# Altium schematic sheet 12 40PIN_FAN.SchDoc: CM4 IO
size 297 x 209 mm; Page Create Date: March  8, 1995; Page Number: 12; Page Size: A4; Comment: radxa_1010; Page Count: 19; RevCode: V1.10; Doc: 12 40PIN/FAN; DsnPath: D:\WMS\黄工\[RC126]CM4_IO_V1.10\[RC126]_V1.10\CM4 IO_V1.10.DSN; SchematicName: CM4 IO V1.10; PageName: 12 40PIN/FAN; PageSize: A4; TopSchematic: True
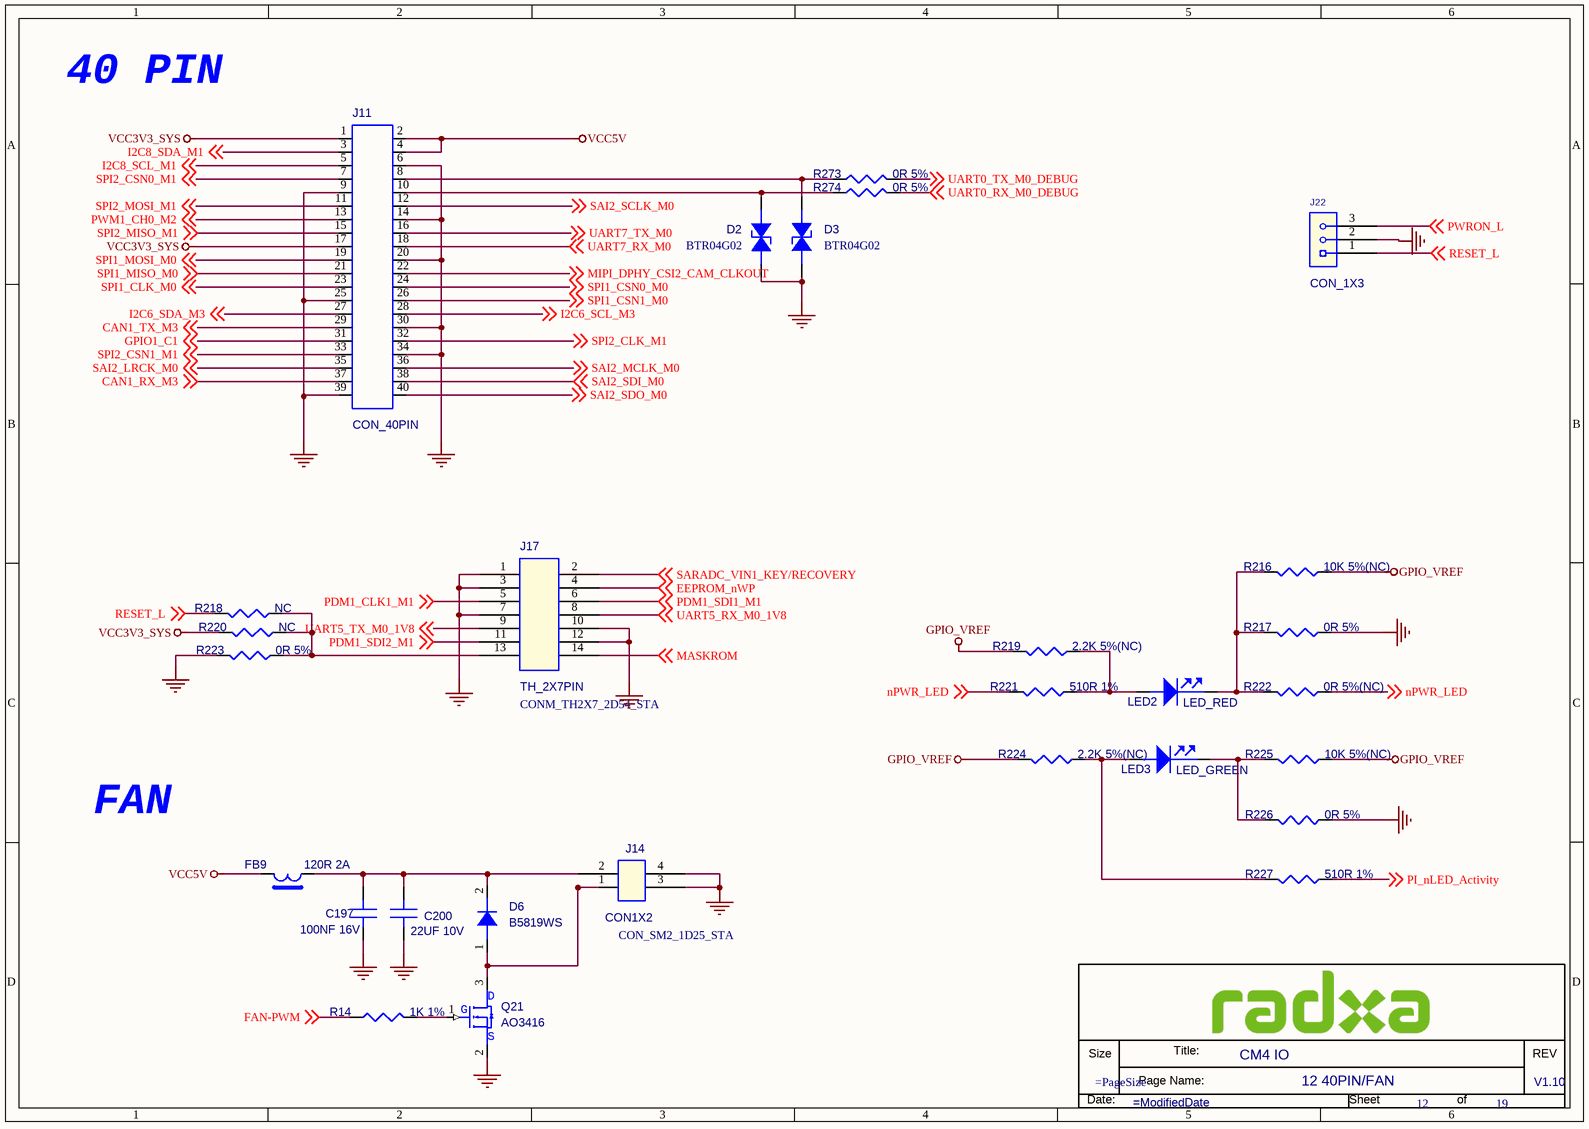
[diagram p0: 12 40PIN_FAN.SchDoc]

## Parts
*  Doc: 12 40PIN/FAN  RevCode: V1.10  Title: CM4 IO  Page Number: 12  Page Count: 19  (hidden comment: radxa_1010)  (graphical)
C197  100NF 16V  [C0201]
C200  22UF 10V  [C0603]
D2  BTR04G02  [DFN1006-2L]
D3  BTR04G02  [DFN1006-2L]
D6  B5819WS  [SOD_323]
FB9  120R 2A  [FB0402]
J11  CON_40PIN  [CON_TH20X2_2D54_STA]
J14  CON1X2  [CON_SM2_1D25_STA]
J17  TH_2X7PIN  [CONM_TH2X7_2D54_STA]
J22  CON_1X3  [CON_TH1X3_2D54_STA]
LED2  LED_RED  [LED_D0603]
LED3  LED_GREEN  [LED_D0603]
Q21  AO3416  [SOT_23]
R14  1K 1%  [R0402]
R216  10K 5%(NC)  [R0402]
R217  0R 5%  [R0402]
R218  NC  [R0402]
R219  2.2K 5%(NC)  [R0402]
R220  NC  [R0402]
R221  510R 1%  [R0402]
R222  0R 5%(NC)  [R0402]
R223  0R 5%  [R0402]
R224  2.2K 5%(NC)  [R0402]
R225  10K 5%(NC)  [R0402]
R226  0R 5%  [R0402]
R227  510R 1%  [R0402]
R273  0R 5%  [R0402]
R274  0R 5%  [R0402]

## Nets
GND: C197.2(B) C200.2(B) D2.2(CATHODE) D3.2(CATHODE) J11.6 J11.9 J11.14 J11.20 J11.25 J11.30 J11.34 J11.39 J14.3 J14.4 J17.1 J17.3 J17.7 J17.10 J17.12 J22.2 Q21.2(S) R217.2 R223.2 R226.2
GPIO_VREF: R216.2 R219.1 R224.1 R225.2
VCC3V3_SYS: J11.1 J11.17 R220.2
VCC5V: FB9.1 J11.2 J11.4
CAN1_RX_M3: J11.37 ; off-sheet CAN1_RX_M3
CAN1_TX_M3: J11.29 ; off-sheet CAN1_TX_M3
EEPROM_nWP: J17.4 ; off-sheet EEPROM_nWP
FAN-PWM: R14.1 ; off-sheet FAN-PWM
GPIO1_C1: J11.31 ; off-sheet GPIO1_C1
I2C6_SCL_M3: J11.28 ; off-sheet I2C6_SCL_M3
I2C6_SDA_M3: J11.27 ; off-sheet I2C6_SDA_M3
I2C8_SCL_M1: J11.5 ; off-sheet I2C8_SCL_M1
I2C8_SDA_M1: J11.3 ; off-sheet I2C8_SDA_M1
MASKROM: J17.14 ; off-sheet MASKROM
MIPI_DPHY_CSI2_CAM_CLKOUT: J11.22 ; off-sheet MIPI_DPHY_CSI2_CAM_CLKOUT
nPWR_LED: R221.1 R222.2 ; off-sheet nPWR_LED
PDM1_CLK1_M1: J17.5 ; off-sheet PDM1_CLK1_M1
PDM1_SDI1_M1: J17.6 ; off-sheet PDM1_SDI1_M1
PDM1_SDI2_M1: J17.11 ; off-sheet PDM1_SDI2_M1
PI_nLED_Activity: R227.2 ; off-sheet PI_nLED_Activity
PWM1_CH0_M2: J11.13 ; off-sheet PWM1_CH0_M2
PWRON_L: J22.3 ; off-sheet PWRON_L
RESET_L: J22.1 R218.2 ; off-sheet RESET_L
SAI2_LRCK_M0: J11.35 ; off-sheet SAI2_LRCK_M0
SAI2_MCLK_M0: J11.36 ; off-sheet SAI2_MCLK_M0
SAI2_SCLK_M0: J11.12 ; off-sheet SAI2_SCLK_M0
SAI2_SDI_M0: J11.38 ; off-sheet SAI2_SDI_M0
SAI2_SDO_M0: J11.40 ; off-sheet SAI2_SDO_M0
SARADC_VIN1_KEY/RECOVERY: J17.2 ; off-sheet SARADC_VIN1_KEY/RECOVERY
SPI1_CLK_M0: J11.23 ; off-sheet SPI1_CLK_M0
SPI1_CSN0_M0: J11.24 ; off-sheet SPI1_CSN0_M0
SPI1_CSN1_M0: J11.26 ; off-sheet SPI1_CSN1_M0
SPI1_MISO_M0: J11.21 ; off-sheet SPI1_MISO_M0
SPI1_MOSI_M0: J11.19 ; off-sheet SPI1_MOSI_M0
SPI2_CLK_M1: J11.32 ; off-sheet SPI2_CLK_M1
SPI2_CSN0_M1: J11.7 ; off-sheet SPI2_CSN0_M1
SPI2_CSN1_M1: J11.33 ; off-sheet SPI2_CSN1_M1
SPI2_MISO_M1: J11.15 ; off-sheet SPI2_MISO_M1
SPI2_MOSI_M1: J11.11 ; off-sheet SPI2_MOSI_M1
UART0_RX_M0_DEBUG: R274.2 ; off-sheet UART0_RX_M0_DEBUG
UART0_TX_M0_DEBUG: R273.2 ; off-sheet UART0_TX_M0_DEBUG
UART5_RX_M0_1V8: J17.8 ; off-sheet UART5_RX_M0_1V8
UART5_TX_M0_1V8: J17.9 ; off-sheet UART5_TX_M0_1V8
UART7_RX_M0: J11.18 ; off-sheet UART7_RX_M0
UART7_TX_M0: J11.16 ; off-sheet UART7_TX_M0
NetC197_1: C197.1(A) C200.1(A) D6.2(K) FB9.2 J14.2
NetD2_1: D2.1(ANODE) J11.10 R274.1
NetD3_1: D3.1(ANODE) J11.8 R273.1
NetD6_1: D6.1(A) J14.1 Q21.3(D)
NetJ17_13: J17.13 R218.1 R220.1 R223.1
NetLED2_1: LED2.1(ANODE) R219.2 R221.2
NetLED2_2: LED2.2(CATHODE) R216.1 R217.1 R222.1
NetLED3_1: LED3.1(ANODE) R224.2 R227.1
NetLED3_2: LED3.2(CATHODE) R225.1 R226.1
NetQ21_1: Q21.1(G) R14.2

## Notes on the sheet
- 40 PIN
- FAN
- (in symbol radxa_1010) Size; Title:; REV; Page Name:; Date:; Sheet; of

## Library data of the parts
C197 = C: SMD  0201  100NF  16V  X5R  ±20%  ROHS; PARTS: 1; Part Reference: C197; Part Number: A1C01.00099; OriginalSymbolOrigin: (0,30); PKG_TYPE: CAP2-100-250; LEVEL: STD; PINSWAP: (A,B); Value: 100NF 16V; Part Type: 陶瓷电容; PCB Footprint: C0201
C200 = C: SMD  0603  22UF  10V  X5R  ±20%  ROHS; PARTS: 1; Part Reference: C200; Part Number: A1C01.00015; OriginalSymbolOrigin: (0,30); PKG_TYPE: CAP2-100-250; LEVEL: STD; PINSWAP: (A,B); Value: 22UF 10V; Part Type: 陶瓷电容; PCB Footprint: C0603
D2 = ESD: SMD  编带  0402  BTR04G02  B-tron  ROHS; Part Reference: D2; Part Number: A1D02.00002; Parameter: ESD-台舟 ESD5341N-封装 esd0402; ID: DE-E0004; Preferred: 6715f349cd0bc5; Temp Coeff: -50℃ to +125℃; PCB Footprint: ESD_D0402; Value: BTR04G02; Part Type: 二极管-ESD管-桥堆-TVS管
D3 = ESD: SMD  编带  0402  BTR04G02  B-tron  ROHS; Part Reference: D3; Part Number: A1D02.00002; Parameter: ESD-台舟 ESD5341N-封装 esd0402; ID: DE-E0004; Temp Coeff: -50℃ to +125℃; Preferred: 6715f349cd0bc5; PCB Footprint: ESD_D0402; Value: BTR04G02; Part Type: 二极管-ESD管-桥堆-TVS管
D6 = DIODE_Dup1: SMD  编带  SOD-323  B5819WS  CJ  ROHS; Part Reference: D6; Manufacturer: 长电; Part Number: A1D02.00005; RK PN: B5819W; Priority: A; Temp Coeff: -55℃ ~ ＋150℃; PCB Footprint: SOD_323; Value: B5819WS; Part Type: 二极管-ESD管-桥堆-TVS管; Manufacturer PN: B5819W; Created by: JJJ
FB9 = BEAD: SMD  0402  FB120R  2A  ±25%  ROHS; Part Reference: FB9; Part Number: A1L09.00004; Preferred: 6715f349cd0bc5; Temp Coeff: -55℃ to +125℃; PCB Footprint: FB0402; Value: 120R 2A; Part Type: 贴片磁珠
J11 = CON_TH2X20: DIP  排针座  2*20PIN  180度  2.54mm脚距  中间朔高2.5mm  针长一端6.1mm  另一端3.0mm  彩色  PH2.54  2*20P  彩印 L=11.6/3.0  国意英  ROHS; Part Reference: J11; Part Number: A1J01.00012; OriginalSymbolOrigin: (-100,550); Preferred: 6715f349cd0bc5; Temp Coeff: -40℃ to +105℃; ANGLE: ?; ASSEMBLY: ?; GENDER: ?; LATCHING: ?; MAX_CURRENT: ?; MAX_VOLTAGE: ?; NV_NAME: ?; NV_PN: ?; PACK_TYPE: ?; PATH: ?; PITCH: ?; PLACEMENT_NOTE: ?; REFLOW: ?; SHROUDED: ?; SKU: COMMON; Value: CON_40PIN; Part Type: 排座; PCB Footprint: CON_TH20X2_2D54_STA
J14 = CON_1X2: SMD  母座  1*2PIN  90度  立贴  1.25mm脚距  9T  X9821WVS-02-9TSN  白色  星坤  ROHS; Part Reference: J14; Part Number: A1J01.00089; Temp Coeff: -25℃ to +85℃; Preferred: 6715f352cd0bcd; Value: CON1X2; Part Type: 连接座; PCB Footprint: CON_SM2_1D25_STA
J17 = TH_2X7PIN: DIP  排针座  2*7PIN  180度  2.54mm脚距  中间朔高2.5mm  针长一端6.1mm  另一端3.0mm  黑色  PH2.54 2*7P L=11.6/3.0 S/T  国意英  ROHS; Part Reference: J17; Part Number: A1J02.00017; Preferred: 6715f349cd0bc5; Value: TH_2X7PIN; Part Type: 排座; PCB Footprint: CONM_TH2X7_2D54_STA
J22 = CON_1X3: DIP  排针座  1*3PIN  180度  2.54mm脚距  中间朔高2.5mm  针长一端6.1mm  另一端3.0mm  材质LCP  黑色  PH2.54 1*3P L=11.6/3.0  国意英  ROHS; Part Reference: J22; Part Number: A1J02.00013; OriginalSymbolOrigin: (-50,50); Temp Coeff: -40°C to +85°C; Preferred: 6715f349cd0bc5; ANGLE: ?; ASSEMBLY: ?; GENDER: ?; LATCHING: ?; MAX_CURRENT: ?; MAX_VOLTAGE: ?; NV_NAME: ?; NV_PN: ?; PACK_TYPE: ?; PATH: ?; PITCH: ?; PLACEMENT_NOTE: ?; REFLOW: ?; SHROUDED: ?; SKU: COMMON; Value: CON_1X3; Part Type: 排座; PCB Footprint: CON_TH1X3_2D54_STA
LED2 = LED: SMD  编带  0603  发红光  单色  mcd=150  IF=20mA  无色散光  EY-PB0603RC-010F  恩域光电  ROHS; Part Reference: LED2; Part Number: A1D03.00003; RK PN: LED_GREEN; Priority: A; Temp Coeff: -40℃ to +85℃; Preferred: 6715f349cd0bc5; PCB Footprint: LED_D0603; Value: LED_RED; Part Type: 发光二极管; Created by: JJJ
LED3 = LED: SMD  编带  0603  发绿光  单色  mcd=150  IF=20mA  无色散光  EY-TB0603GC-010F  恩域光电  ROHS; Part Reference: LED3; Part Number: A1D03.00002; Priority: A; Temp Coeff: -40℃ to +85℃; PCB Footprint: LED_D0603; Value: LED_GREEN; RK PN: LED_GREEN; Part Type: 发光二极管; Created by: JJJ
Q21 = MOSFET_NPN: SMD  编带  SOT-23-3L  AO3416  N沟道  AOS  ROHS; Part Reference: Q21; Part Number: A1D01.00010; Temp Coeff: -55℃ to ＋150℃; Value: AO3416; Part Type: 三极管-MOS管; PCB Footprint: SOT_23
R14 = R: SMD  0201  1K  1/20W  ±1%  ROHS; Part Reference: R14; Part Number: A1R01.00111; PCB Footprint: R0201; Preferred: 6715f349cd0bc5; Value: 1K 1%; Part Type: 贴片电阻
R216 = R: SMD  0201  10K  1/20W  ±5%  ROHS; Part Reference: R216; Part Number: A1R01.00012; PCB Footprint: R0201; Temp Coeff: -55℃ to +125℃; Preferred: 6715f349cd0bc5; Value: 10K 5%(NC); Part Type: 贴片电阻
R217 = R: SMD  0201  0R  1/20W  ±5%  ROHS; Part Reference: R217; Part Number: A1R01.00027; PCB Footprint: R0201; Preferred: 6715f349cd0bc5; Temp Coeff: -55℃ to +125℃; Value: 0R 5%; Part Type: 贴片电阻
R218 = R: SMD  0201  0R  1/20W  ±5%  ROHS; Part Reference: R218; Part Number: A1R01.00027; PCB Footprint: R0201; Preferred: 6715f349cd0bc5; Temp Coeff: -55℃ to +125℃; Value: NC; Part Type: 贴片电阻
R219 = R: SMD  0201  2.2K  1/20W  ±5%  ROHS; Part Reference: R219; Part Number: A1R01.00016; PCB Footprint: R0201; Preferred: 6715f349cd0bc5; Temp Coeff: -55℃ to +125℃; Value: 2.2K 5%(NC); Part Type: 贴片电阻
R220 = R: SMD  0201  10K  1/20W  ±5%  ROHS; Part Reference: R220; Part Number: A1R01.00012; PCB Footprint: R0201; Preferred: 6715f349cd0bc5; Temp Coeff: -55℃ to +125℃; Value: NC; Part Type: 贴片电阻
R221 = R: SMD  0201  2.2K  1/20W  ±5%  ROHS; Part Reference: R221; Part Number: A1R01.00016; PCB Footprint: R0201; Preferred: 6715f349cd0bc5; Temp Coeff: -55℃ to +125℃; Value: 510R 1%; Part Type: 贴片电阻
R222 = R: SMD  0201  0R  1/20W  ±5%  ROHS; Part Reference: R222; Part Number: A1R01.00027; PCB Footprint: R0201; Temp Coeff: -55℃ to +125℃; Preferred: 6715f349cd0bc5; Value: 0R 5%(NC); Part Type: 贴片电阻
R223 = R: SMD  0201  0R  1/20W  ±5%  ROHS; Part Reference: R223; Part Number: A1R01.00027; PCB Footprint: R0201; Temp Coeff: -55℃ to +125℃; Preferred: 6715f349cd0bc5; Value: 0R 5%; Part Type: 贴片电阻
R224 = R: SMD  0201  2.2K  1/20W  ±5%  ROHS; Part Reference: R224; Part Number: A1R01.00016; PCB Footprint: R0201; Temp Coeff: -55℃ to +125℃; Preferred: 6715f349cd0bc5; Value: 2.2K 5%(NC); Part Type: 贴片电阻
R225 = R: SMD  0201  10K  1/20W  ±5%  ROHS; Part Reference: R225; Part Number: A1R01.00012; PCB Footprint: R0201; Temp Coeff: -55℃ to +125℃; Preferred: 6715f349cd0bc5; Value: 10K 5%(NC); Part Type: 贴片电阻
R226 = R: SMD  0201  0R  1/20W  ±5%  ROHS; Part Reference: R226; Part Number: A1R01.00027; PCB Footprint: R0201; Preferred: 6715f349cd0bc5; Temp Coeff: -55℃ to +125℃; Value: 0R 5%; Part Type: 贴片电阻
R227 = R: SMD  0201  0R  1/20W  ±5%  ROHS; Part Reference: R227; Part Number: A1R01.00027; PCB Footprint: R0201; Preferred: 6715f349cd0bc5; Temp Coeff: -55℃ to +125℃; Value: 510R 1%; Part Type: 贴片电阻
R273 = R: SMD  0201  0R  1/20W  ±5%  ROHS; Part Reference: R273; Part Number: A1R01.00027; PCB Footprint: R0201; Temp Coeff: -55℃ to +125℃; Preferred: 6715f349cd0bc5; Value: 0R 5%; Part Type: 贴片电阻
R274 = R: SMD  0201  0R  1/20W  ±5%  ROHS; Part Reference: R274; Part Number: A1R01.00027; PCB Footprint: R0201; Temp Coeff: -55℃ to +125℃; Preferred: 6715f349cd0bc5; Value: 0R 5%; Part Type: 贴片电阻
* = radxa_1010: Page Create Date: March  8, 1995; Page Size: =PageSize; Page Modify Date: =ModifiedDate